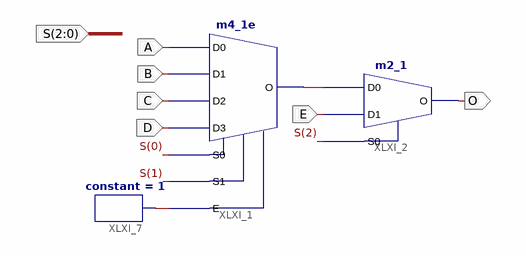
[diagram p0: schematic sheet 1]
// Xilinx ISE schematic mux5b1.sch (spartan3e) as structural Verilog: 3 symbols, 7 ports
module mux5b1 (
  input  A,
  input  B,
  input  C,
  input  D,
  input  E,
  input  [2:0] S,
  output O
);

  wire XLXN_13, XLXN_20;

  m4_1e XLXI_1 (.D0(A), .D1(B), .D2(C), .D3(D), .E(XLXN_20), .S0(S[0]), .S1(S[1]), .O(XLXN_13));
  m2_1 XLXI_2 (.D0(XLXN_13), .D1(E), .S0(S[2]), .O(O));
  constant #(.CValue("1")) XLXI_7 (.O(XLXN_20));
endmodule
